# Altium schematic sheet power.SchDoc: Power
size A4
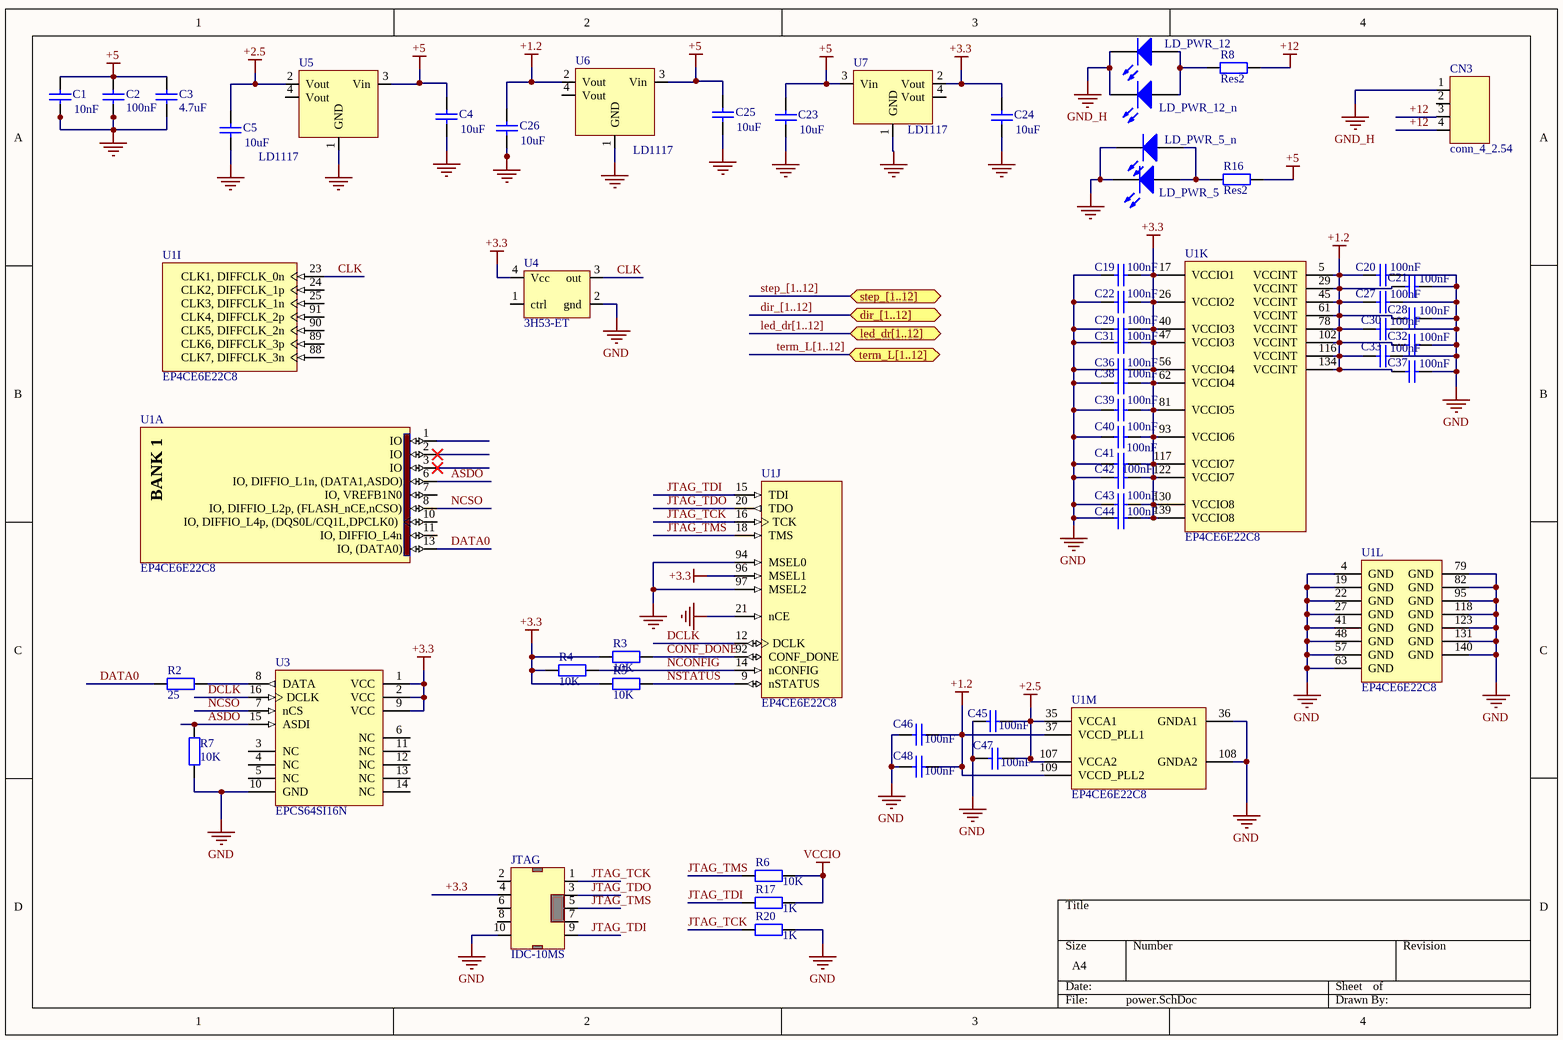
[diagram p0: power.SchDoc]

## Parts
C1  value 10nF  [CAPC1608M]  (hidden comment: Cap)
C2  value 100nF  [CAPC1608M]  (hidden comment: Cap)
C3  value 4.7uF  [CAPC1608M]  (hidden comment: Cap)
C4  value 10uF  [CAPC2012M]  (hidden comment: Cap)
C5  value 10uF  [CAPC2012M]  (hidden comment: Cap)
C19  value 100nF  [CAPC1608M]  (hidden comment: Cap)
C20  value 100nF  [CAPC1608M]  (hidden comment: Cap)
C21  value 100nF  [CAPC1608M]  (hidden comment: Cap)
C22  value 100nF  [CAPC1608M]  (hidden comment: Cap)
C23  value 10uF  [CAPC2012M]  (hidden comment: Cap)
C24  value 10uF  [CAPC2012M]  (hidden comment: Cap)
C25  value 10uF  [CAPC2012M]  (hidden comment: Cap)
C26  value 10uF  [CAPC2012M]  (hidden comment: Cap)
C27  value 100nF  [CAPC1608M]  (hidden comment: Cap)
C28  value 100nF  [CAPC1608M]  (hidden comment: Cap)
C29  value 100nF  [CAPC1608M]  (hidden comment: Cap)
C30  value 100nF  [CAPC1608M]  (hidden comment: Cap)
C31  value 100nF  [CAPC1608M]  (hidden comment: Cap)
C32  value 100nF  [CAPC1608M]  (hidden comment: Cap)
C33  value 100nF  [CAPC1608M]  (hidden comment: Cap)
C36  value 100nF  [CAPC1608M]  (hidden comment: Cap)
C37  value 100nF  [CAPC1608M]  (hidden comment: Cap)
C38  value 100nF  [CAPC1608M]  (hidden comment: Cap)
C39  value 100nF  [CAPC1608M]  (hidden comment: Cap)
C40  value 100nF  [CAPC1608M]  (hidden comment: Cap)
C41  value 100nF  [CAPC1608M]  (hidden comment: Cap)
C42  value 100nF  [CAPC1608M]  (hidden comment: Cap)
C43  value 100nF  [CAPC1608M]  (hidden comment: Cap)
C44  value 100nF  [CAPC1608M]  (hidden comment: Cap)
C45  value 100nF  [CAPC1608M]  (hidden comment: Cap)
C46  value 100nF  [CAPC1608M]  (hidden comment: Cap)
C47  value 100nF  [CAPC1608M]  (hidden comment: Cap)
C48  value 100nF  [CAPC1608M]  (hidden comment: Cap)
CN3  conn_4_2.54  [SCKT/SM4.5-2H4]
JTAG  IDC-10MS  [IDC2.54-V10D]
LD_PWR_5  led  [RESC2012M]  (value not drawn)
LD_PWR_5_n  led  [led-pins]  (value not drawn)
LD_PWR_12  led  [RESC2012M]  (value not drawn)
LD_PWR_12_n  led  [led-pins]  (value not drawn)
R2  25  [RESC2012M]
R3  10K  [RESC2012M]
R4  10K  [RESC2012M]
R5  10K  [RESC2012M]
R6  10K  [RESC2012M]
R7  value 10K  [RESC2012M]  (hidden comment: Res2)
R8  Res2  [RESC2012M]
R16  Res2  [RESC2012M]
R17  1K  [RESC2012M]
R20  1K  [RESC2012M]
U1  EP4CE6E22C8  [EQFP144_M]  (parts A,I,J,K,L,M of 13)
U3  EPCS64SI16N  [SOIC16_M]
U4  3H53-ET  [2SMX-3SMXB]
U5  LD1117  [SOT223-4M]
U6  LD1117  [SOT223-4M]
U7  LD1117  [SOT223-4M]

## Ports
dir_[1..12], led_dr[1..12], step_[1..12], term_L[1..12]

## Nets
+1.2: C20.1 C21.1 C26.1 C27.1 C28.1 C30.1 C32.1 C33.1 C37.1 C46.2 C48.2 U1.5(VCCINT) U1.29(VCCINT) U1.37(VCCD_PLL1) U1.45(VCCINT) U1.61(VCCINT) U1.78(VCCINT) U1.102(VCCINT) U1.109(VCCD_PLL2) U1.116(VCCINT) U1.134(VCCINT) U6.2(Vout)
+2.5: C5.1 C45.2 C47.2 U1.35(VCCA1) U1.107(VCCA2) U5.2(Vout)
+3.3: C19.2 C22.2 C24.1 C29.2 C31.2 C36.2 C38.2 C39.2 C40.2 C41.2 C42.2 C43.2 C44.2 JTAG.4 R3.1 R4.1 R5.1 U1.17(VCCIO1) U1.26(VCCIO2) U1.40(VCCIO3) U1.47(VCCIO3) U1.56(VCCIO4) U1.62(VCCIO4) U1.81(VCCIO5) U1.93(VCCIO6) U1.96(MSEL1) U1.117(VCCIO7) U1.122(VCCIO7) U1.130(VCCIO8) U1.139(VCCIO8) U3.1(VCC) U3.2(VCC) U3.9(VCC) U4.4(Vcc) U7.2(Vout)
+5: C1.1 C2.1 C3.1 C4.1 C23.1 C25.1 R16.2 U5.3(Vin) U6.3(Vin) U7.3(Vin)
+12: CN3.3 CN3.4 R8.2
GND: C1.2 C2.2 C3.2 C4.2 C5.2 C19.1 C20.2 C21.2 C22.1 C23.2 C24.2 C25.2 C26.2 C27.2 C28.2 C29.1 C30.2 C31.1 C32.2 C33.2 C36.1 C37.2 C38.1 C39.1 C40.1 C41.1 C42.1 C43.1 C44.1 C45.1 C46.1 C47.1 C48.1 JTAG.10 LD_PWR_5.2(K) LD_PWR_5_n.2(K) R7.1 R20.2 U1.4(GND) U1.19(GND) U1.21(nCE) U1.22(GND) U1.27(GND) U1.36(GNDA1) U1.41(GND) U1.48(GND) U1.57(GND) U1.63(GND) U1.79(GND) U1.82(GND) U1.94(MSEL0) U1.95(GND) U1.97(MSEL2) U1.108(GNDA2) U1.118(GND) U1.123(GND) U1.131(GND) U1.140(GND) U3.10(GND) U4.2(gnd) U5.1(GND) U6.1(GND) U7.1(GND)
GND_H: CN3.1 LD_PWR_12.2(K) LD_PWR_12_n.2(K)
VCCIO: R6.2 R17.2
ASDO: R7.2 U1.6(IO,_DIFFIO_L1n,_(DATA1,ASDO)) U3.15(ASDI)
CLK: U1.23(CLK1,_DIFFCLK_0n) U4.3(out)
CONF_DONE: R3.2 U1.92(CONF_DONE)
DATA0: R2.1 U1.13(IO,_(DATA0))
DCLK: U1.12(DCLK) U3.16(DCLK)
JTAG_TCK: JTAG.1 R20.1 U1.16(TCK)
JTAG_TDI: JTAG.9 R17.1 U1.15(TDI)
JTAG_TDO: JTAG.3 U1.20(TDO)
JTAG_TMS: JTAG.5 R6.1 U1.18(TMS)
NCONFIG: R4.2 U1.14(nCONFIG)
NCSO: U1.8(IO,_DIFFIO_L2p,_(FLASH_nCE,nCSO)) U3.7(nCS)
NSTATUS: R5.2 U1.9(nSTATUS)
NetLD_PWR_5_1: LD_PWR_5.1(A) LD_PWR_5_n.1(A) R16.1
NetLD_PWR_12_1: LD_PWR_12.1(A) LD_PWR_12_n.1(A) R8.1
NetR2_2: R2.2 U3.8(DATA)

Not connected (* = marked no-connect by the designer): CN3 2; JTAG 2 6 7 8; U1 1(IO) 2(IO)* 3(IO)* 7(IO,_VREFB1N0) 10(IO,_DIFFIO_L4p,_(DQS0L/CQ1L,DPCLK0)) 11(IO,_DIFFIO_L4n) 24(CLK2,_DIFFCLK_1p) 25(CLK3,_DIFFCLK_1n) 88(CLK7,_DIFFCLK_3n) 89(CLK6,_DIFFCLK_3p) 90(CLK5,_DIFFCLK_2n) 91(CLK4,_DIFFCLK_2p); U3 3(NC) 4(NC) 5(NC) 6(NC) 11(NC) 12(NC) 13(NC) 14(NC); U4 1(ctrl); U5 4(Vout); U6 4(Vout); U7 4(Vout)

## Buses and harness runs
bus dir_[1..12] = port dir_[1..12]
bus led_dr[1..12] = port led_dr[1..12]
bus step_[1..12] = port step_[1..12]
bus term_L[1..12] = port term_L[1..12]

## Notes on the sheet
- (in symbol EP4CE6E22C8, part A) BANK 1

## Library data of the parts
C1-C5 C19-C33 C36-C48 = Cap: Capacitor; Published: 8-Jun-2000; LatestRevisionDate: 17-Jul-2002; LatestRevisionNote: Re-released for DXP Platform.; PackageReference: RAD-0.3; Publisher: Altium Limited; PackageDescription: Radial Cap, Thru-Hole; 2 Leads; 0.3 in Pin Spacing
JTAG = BH-10(IDC-10MS)
LD_PWR_5 LD_PWR_5_n LD_PWR_12 LD_PWR_12_n = chip led
R2-R6 R8 R16 = Res2: Resistor; Value: 1K; Published: 8-Jun-2000; LatestRevisionDate: 17-Jul-2002; LatestRevisionNote: Re-released for DXP Platform.; PackageReference: AXIAL-0.4; Publisher: Altium Limited; PackageDescription: Axial Device, Thru-Hole; 2 Leads; 0.4 in Pin Spacing
R7 R17 R20 = Res2: Resistor; Published: 8-Jun-2000; LatestRevisionDate: 17-Jul-2002; LatestRevisionNote: Re-released for DXP Platform.; PackageReference: AXIAL-0.4; Publisher: Altium Limited; PackageDescription: Axial Device, Thru-Hole; 2 Leads; 0.4 in Pin Spacing
  R17 R20: Value: 1K
U1 = EP4CE6E22C8: Cyclone IV Family FPGA, 2V Core, 91 I/O Pins, 2 PLLs, 144-Pin QFP, Speed Grade 8, Commercial Grade; Published: 3-May-2010; DatasheetVersion: ver1.2, Mar-2010; PackageVersion: ver16.0, Dec-2009; PackageReference: EQFP144; Publisher: Altium Limited; PackageDescription: 144-Pin Plastic Enhanced Quad Flat Pack (EQFP144) - Wire Bond; Supplier 1: Digi-Key; Supplier Part Number 1: EP4CE6E22C8-ND; Code_JEDEC: MS-026-BFB; ComponentLink1Description: Manufacturer Link; ComponentLink1URL: http://www.altera.com/; ComponentLink2Description: Handbook; ComponentLink2URL: http://www.altera.com/literature/hb/cyclone-iv/cyclone4-handbook.pdf; ComponentLink3Description: Pinout Specification; ComponentLink3URL: http://www.altera.com/literature/lit-dp.jsp?category=cyc%204&showspreadsheet=y; ComponentLink4Description: Packaging Specification; ComponentLink4URL: http://www.altera.com/literature/ds/dspkg.pdf
U3 = EPCS64SI16N: EPCS64 Series, In-system programmable 3.3V serial configuration device, 16-Pin SOIC, 64-Megabit, Industrial Grade, Pb-Free; Configures: Cyclone II, Stratix II, & Cyclone Devices; Published: 4-Mar-2005; LatestRevisionDate: 13-Apr-2006; LatestRevisionNote: IPC-7351 Footprint Added.; DatasheetVersion: ver2.0, Oct-2003; PackageVersion: ver14.2, Oct-2005; PackageReference: SOIC16; Publisher: Altium Limited; PackageDescription: 16-Pin Small Outline Integrated Circuit Package (SOIC16); Supplier 1: Digi-Key; Supplier Part Number 1: 544-1380-5-ND; Code_JEDEC: MS-013-AA; Code_IPC: SOIC127P1030-16; ComponentLink1Description: Manufacturer Link; ComponentLink1URL: http://www.altera.com/products/devices/config/cfg-index.html; ComponentLink2Description: Configuration Handbook; ComponentLink2URL: http://www.altera.com/literature/hb/cfg/config_handbook.pdf; ComponentLink3Description: Pinout Specification; ComponentLink3URL: http://www.altera.com/literature/hb/cfg/config_handbook.pdf; ComponentLink4Description: Packaging Specification; ComponentLink4URL: http://www.altera.com/support/devices/packaging/specifications/pkg-pin/pdf/016-SOIC.pdf
U4 = 3H53-ET: Кварцевый генератор
U5 U6 = LD1086D2T: st LD1086D2T
U7 = ADP3339: ADP3339AKCZ-3.3-R7